# Altium schematic sheet Page-1.schdoc: CPU Module
size 320 x 360 mm; CompanyName: InSYS; DrawnBy: NaveenKumar; Revision: 2.0; SheetNumber: 1; SheetTotal: 10; Title2: Gateway
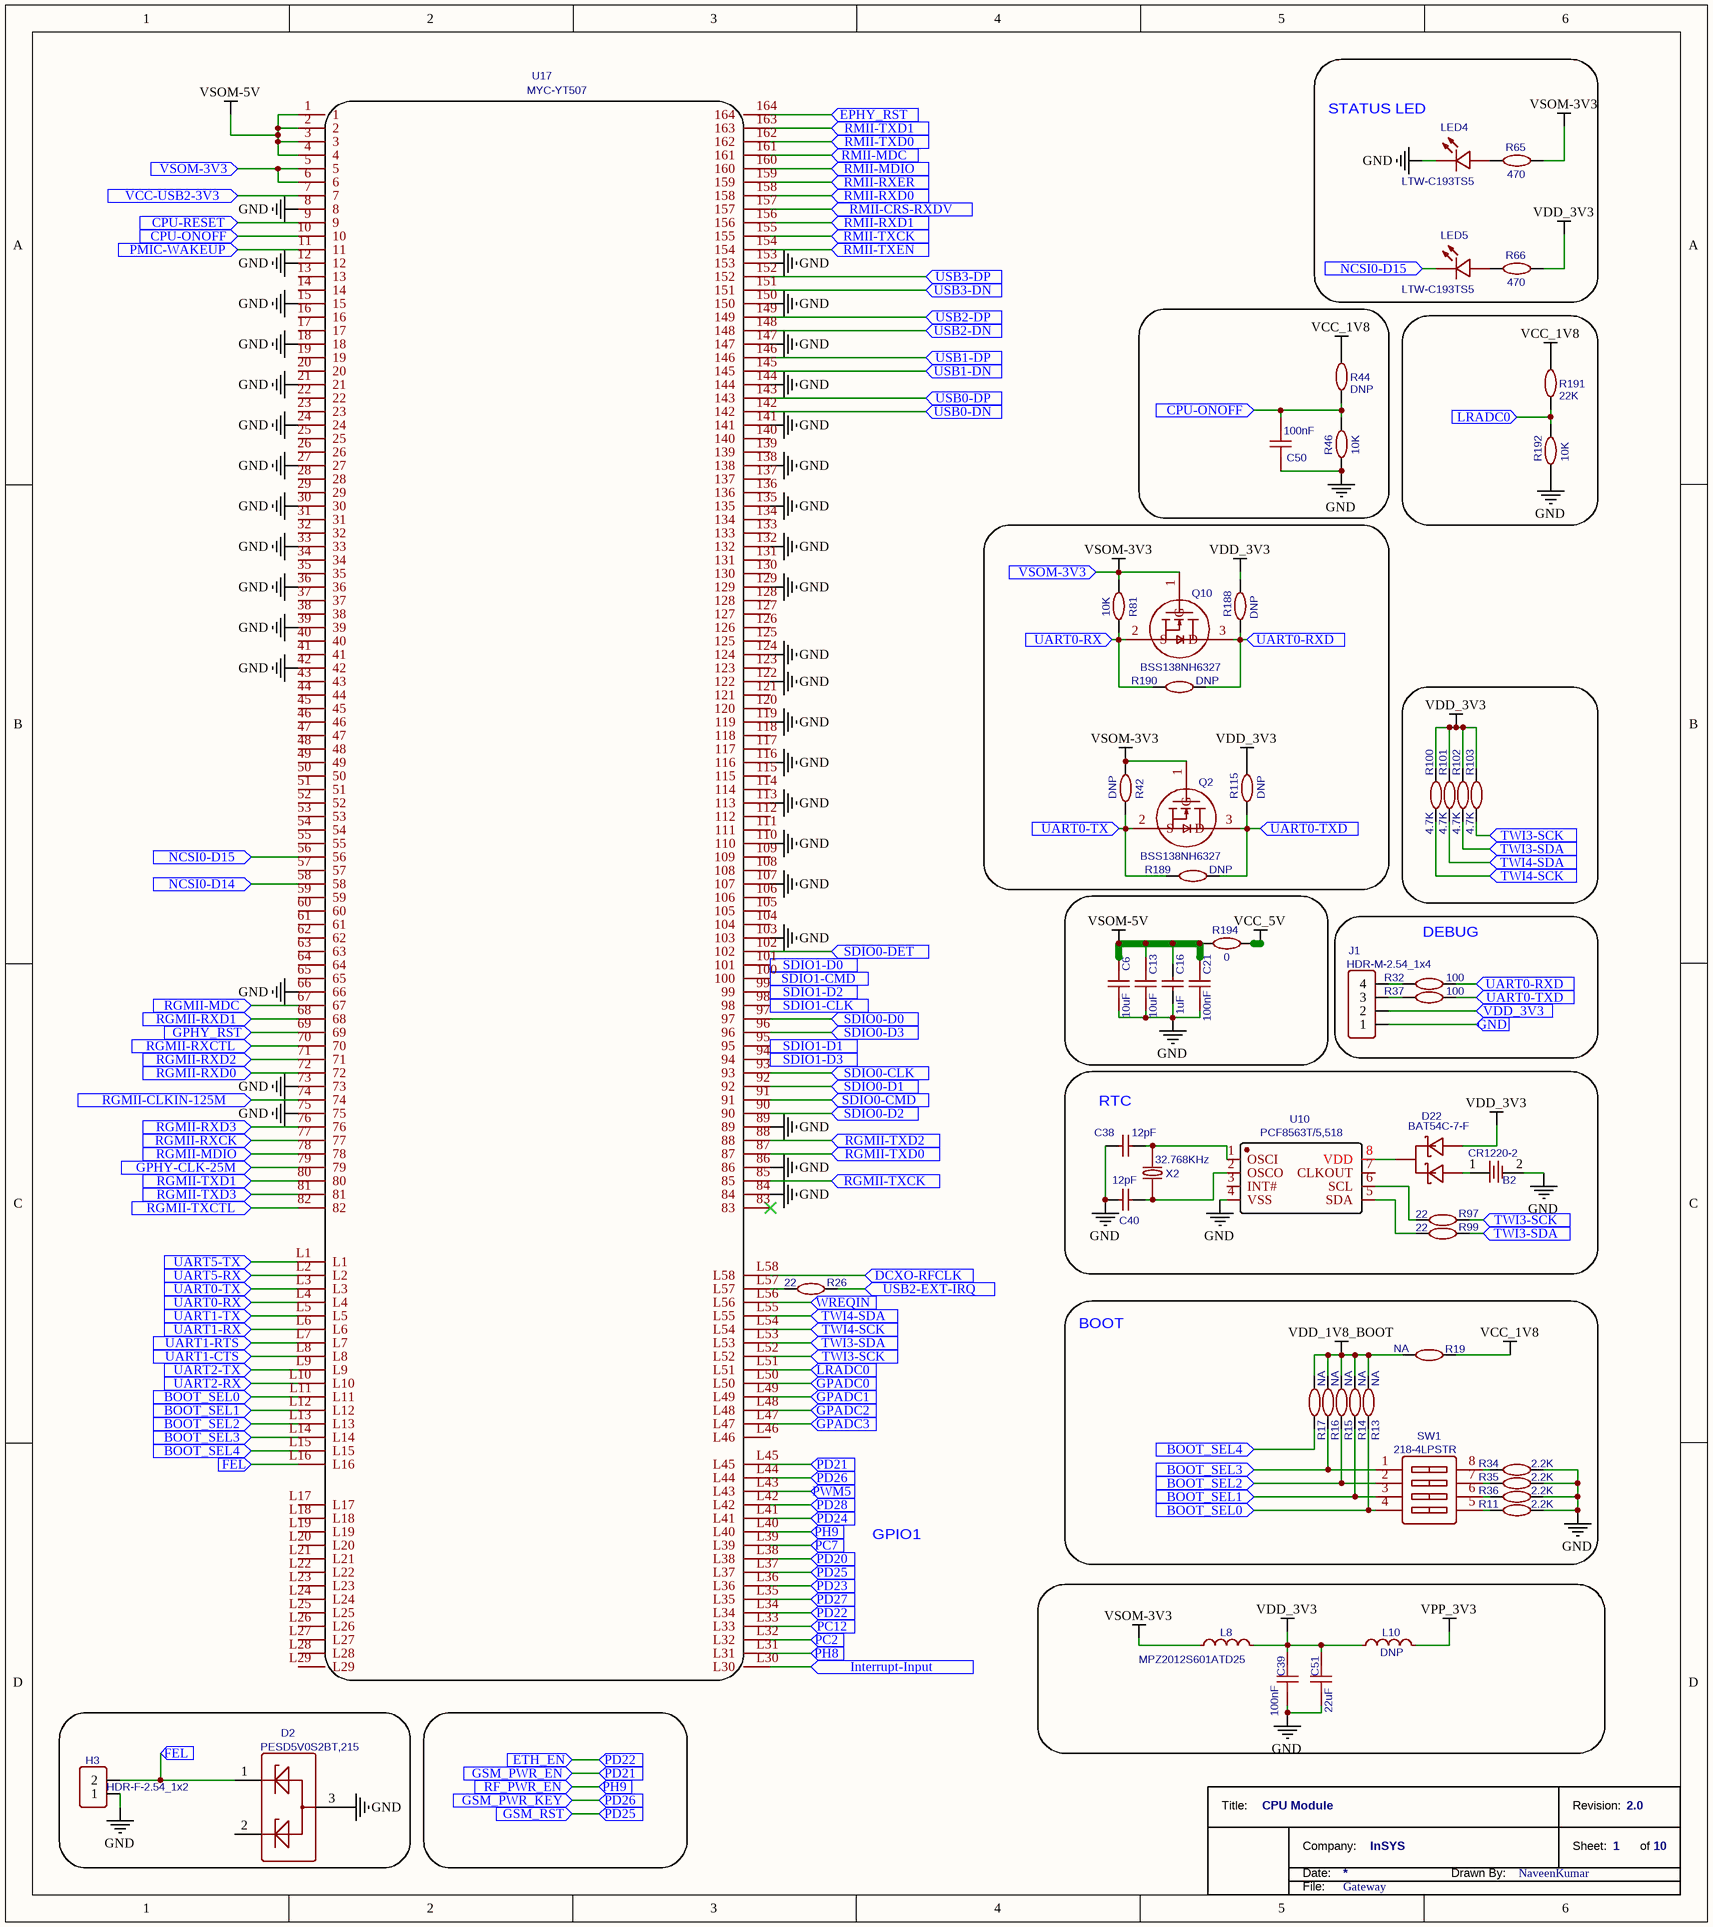
[diagram p0: Page-1.schdoc]

## Parts
*  TitleBlock_1  (value not drawn)  (graphical)
B2  CR1220-2  [GWAY_CR12202_SMD_Holder]
C6  10uF  [GWAY_Capacitor_0805]
C13  10uF  [GWAY_Capacitor_0805]
C16  1uF  [GWAY_Capacitor_0603]
C21  100nF  [GWAY_Capacitor_0603]
C38  12pF  [GWAY_Capacitor_0603]
C39  100nF  [GWAY_Capacitor_0603]
C40  12pF  [GWAY_Capacitor_0603]
C50  100nF  [GWAY_Capacitor_0603]
C51  22uF  [GWAY_Capacitor_0805]
D2  PESD5V0S2BT,215  [GWAY_SOT23-3PIN]
D22  BAT54C-7-F  [GWAY_SOT23-3PIN]
H3  HDR-F-2.54_1x2  [GWAY_2Way_Header_Conn]
J1  HDR-M-2.54_1x4  [GWAY_4Way_Header_Conn]
L8  MPZ2012S601ATD25  [GWAY_FerriteeBEAD_0805_C2012X105N]
L10  DNP  [GWAY_FerriteeBEAD_0805_C2012X105N]
LED4  LTW-C193TS5  [GWAY_Led_RED_0603]
LED5  LTW-C193TS5  [GWAY_Led_RED_0603]
Q2  BSS138NH6327  [GWAY_SOT23-3PIN]
Q10  BSS138NH6327  [GWAY_SOT23-3PIN]
R11  2.2K  [GWAY_Resistor_0603]
R13  NA  [GWAY_Resistor_0603]
R14  NA  [GWAY_Resistor_0603]
R15  NA  [GWAY_Resistor_0603]
R16  NA  [GWAY_Resistor_0603]
R17  NA  [GWAY_Resistor_0603]
R19  NA  [GWAY_Resistor_0603]
R26  22  [GWAY_Resistor_0603]
R32  100  [GWAY_Resistor_0603]
R34  2.2K  [GWAY_Resistor_0603]
R35  2.2K  [GWAY_Resistor_0603]
R36  2.2K  [GWAY_Resistor_0603]
R37  100  [GWAY_Resistor_0603]
R42  DNP  [GWAY_Resistor_0603]
R44  DNP  [GWAY_Resistor_0805]
R46  10K  [GWAY_Resistor_0603]
R65  470  [GWAY_Resistor_0603]
R66  470  [GWAY_Resistor_0603]
R81  10K  [GWAY_Resistor_0603]
R97  22  [GWAY_Resistor_0603]
R99  22  [GWAY_Resistor_0603]
R100  4.7K  [GWAY_Resistor_0603]
R101  4.7K  [GWAY_Resistor_0603]
R102  4.7K  [GWAY_Resistor_0603]
R103  4.7K  [GWAY_Resistor_0603]
R115  DNP  [GWAY_Resistor_0603]
R188  DNP  [GWAY_Resistor_0603]
R189  DNP  [GWAY_Resistor_0603]
R190  DNP  [GWAY_Resistor_0603]
R191  22K  [GWAY_Resistor_0805]
R192  10K  [GWAY_Resistor_0603]
R194  0  [GWAY_Resistor_0603]
SW1  218-4LPSTR  [GWAY_SW-SMD_218-4LPSTR]
U10  PCF8563T/5,518  [GWay_SOIC8]
U17  MYC-YT507  [GWay_MYC-YT507]
X2  32.768KHz  [GWAY_CRYSTAL 32.768MHZ_SMD]

## Blocks framed on the sheet
STATUS LED: LED4 LED5 R65 R66
DEBUG: J1 R32 R37
RTC: B2 C38 C40 D22 R97 R99 U10 X2
BOOT: R11 R13-R17 R19 R34-R36 SW1

## Ports
BOOT_SEL0 (in), BOOT_SEL1 (in), BOOT_SEL2 (in), BOOT_SEL3 (in), BOOT_SEL4 (in), CPU-ONOFF (in), CPU-RESET (in), DCXO-RFCLK (in), EPHY_RST (in), ETH_EN (in), FEL (in), GND (in), GPADC0 (in), GPADC1 (in), GPADC2 (in), GPADC3 (in), GPHY-CLK-25M (in), GPHY_RST (in), GSM_PWR_EN (in), GSM_PWR_KEY (in), GSM_RST (in), Interrupt-Input (in), LRADC0 (in), NCSI0-D14 (in), NCSI0-D15 (in), PC2 (in), PC7 (in), PC12 (in), PD20 (in), PD21 (in), PD22 (in), PD23 (in), PD24 (in), PD25 (in), PD26 (in), PD27 (in), PD28 (in), PH8 (in), PH9 (in), PMIC-WAKEUP (in), PWM5 (in), RF_PWR_EN (in), RGMII-CLKIN-125M (in), RGMII-MDC (in), RGMII-MDIO (in), RGMII-RXCK (in), RGMII-RXCTL (in), RGMII-RXD0 (in), RGMII-RXD1 (in), RGMII-RXD2 (in), RGMII-RXD3 (in), RGMII-TXCK (in), RGMII-TXCTL (in), RGMII-TXD0 (in), RGMII-TXD1 (in), RGMII-TXD2 (in), RGMII-TXD3 (in), RMII-CRS-RXDV (in), RMII-MDC (in), RMII-MDIO (in), RMII-RXD0 (in), RMII-RXD1 (in), RMII-RXER (in), RMII-TXCK (in), RMII-TXD0 (in), RMII-TXD1 (in), RMII-TXEN (in), SDIO0-CLK (in), SDIO0-CMD (in), SDIO0-D0 (in), SDIO0-D1 (in), SDIO0-D2 (in), SDIO0-D3 (in), SDIO0-DET (in), SDIO1-CLK (in), SDIO1-CMD (in), SDIO1-D0 (in), SDIO1-D1 (in), SDIO1-D2 (in), SDIO1-D3 (in), TWI3-SCK (in), TWI3-SDA (in), TWI4-SCK (in), TWI4-SDA (in), UART0-RX (in), UART0-RXD (in), UART0-TX (in), UART0-TXD (in), UART1-CTS (in), UART1-RTS (in), UART1-RX (in), UART1-TX (in), UART2-RX (in), UART2-TX (in), UART5-RX (in), UART5-TX (in), USB0-DN (in), USB0-DP (in), USB1-DN (in), USB1-DP (in), USB2-DN (in), USB2-DP (in), USB2-EXT-IRQ (in), USB3-DN (in), USB3-DP (in), VCC-USB2-3V3 (in), VDD_3V3 (in), VSOM-3V3 (in), WREQIN (in)

## Nets
GND: B2.2 C6.1 C13.1 C16.2 C21.1 C38.1 C39.2 C40.1 C50.2 C51.1 D2.3 H3.1 LED4.1(-) R11.1 R34.1 R35.1 R36.1 R46.1 R192.1 U10.4(VSS) U17.8 U17.12 U17.15 U17.18 U17.21 U17.24 U17.27 U17.30 U17.33 U17.36 U17.39 U17.42 U17.66 U17.73 U17.75 U17.84 U17.86 U17.89 U17.103 U17.107 U17.110 U17.113 U17.116 U17.119 U17.122 U17.124 U17.129 U17.132 U17.135 U17.138 U17.141 U17.144 U17.147 U17.150 U17.153
VCC_1V8: R19.1 R44.2 R191.2
VCC_5V: R194.1
VDD_1V8_BOOT: R13.2 R14.2 R15.2 R16.2 R17.2 R19.2
VDD_3V3: C39.1 C51.2 D22.2(A) L8.2 L10.1 R66.2 R100.2 R101.2 R102.2 R103.2 R115.2 R188.2
VPP_3V3: L10.2
VSOM-3V3: L8.1 Q2.1(G) Q10.1(G) R42.2 R65.2 R81.2 U17.5 U17.6 ; port VSOM-3V3
VSOM-5V: C6.2 C13.2 C16.1 C21.2 R194.2 U17.1 U17.2 U17.3 U17.4
BOOT_SEL0: R13.1 SW1.4 U17.L11 ; port BOOT_SEL0
BOOT_SEL1: R14.1 SW1.3 U17.L12 ; port BOOT_SEL1
BOOT_SEL2: R15.1 SW1.2 U17.L13 ; port BOOT_SEL2
BOOT_SEL3: R16.1 SW1.1 U17.L14 ; port BOOT_SEL3
BOOT_SEL4: R17.1 U17.L15 ; port BOOT_SEL4
CPU-ONOFF: C50.1 R44.1 R46.2 U17.10 ; port CPU-ONOFF
CPU-RESET: U17.9 ; port CPU-RESET
DCXO-RFCLK: U17.L58 ; port DCXO-RFCLK
EPHY_RST: U17.164 ; port EPHY_RST
ETH_EN: U17.L34 ; port PD22, port ETH_EN
FEL: D2.1 H3.2 U17.L16 ; port FEL
GND: J1.1 ; port GND  [a separate net that carries the same name]
GPADC0: U17.L50 ; port GPADC0
GPADC1: U17.L49 ; port GPADC1
GPADC2: U17.L48 ; port GPADC2
GPADC3: U17.L47 ; port GPADC3
GPHY-CLK-25M: U17.79 ; port GPHY-CLK-25M
GPHY_RST: U17.69 ; port GPHY_RST
GSM_PWR_EN: U17.L45 ; port GSM_PWR_EN, port PD21
GSM_PWR_KEY: U17.L44 ; port GSM_PWR_KEY, port PD26
GSM_RST: U17.L37 ; port PD25, port GSM_RST
Interrupt-Input: U17.L30 ; port Interrupt-Input
LRADC0: R191.1 R192.2 U17.L51 ; port LRADC0
NCSI0-D14: U17.58 ; port NCSI0-D14
NCSI0-D15: LED5.1(-) U17.56 ; port NCSI0-D15
PC2: U17.L32 ; port PC2
PC7: U17.L39 ; port PC7
PC12: U17.L33 ; port PC12
PD20: U17.L38 ; port PD20
PD23: U17.L36 ; port PD23
PD24: U17.L41 ; port PD24
PD27: U17.L35 ; port PD27
PD28: U17.L42 ; port PD28
PH8: U17.L31 ; port PH8
PH9: U17.L40 ; port RF_PWR_EN, port PH9
PMIC-WAKEUP: U17.11 ; port PMIC-WAKEUP
PWM5: U17.L43 ; port PWM5
RGMII-CLKIN-125M: U17.74 ; port RGMII-CLKIN-125M
RGMII-MDC: U17.67 ; port RGMII-MDC
RGMII-MDIO: U17.78 ; port RGMII-MDIO
RGMII-RXCK: U17.77 ; port RGMII-RXCK
RGMII-RXCTL: U17.70 ; port RGMII-RXCTL
RGMII-RXD0: U17.72 ; port RGMII-RXD0
RGMII-RXD1: U17.68 ; port RGMII-RXD1
RGMII-RXD2: U17.71 ; port RGMII-RXD2
RGMII-RXD3: U17.76 ; port RGMII-RXD3
RGMII-TXCK: U17.85 ; port RGMII-TXCK
RGMII-TXCTL: U17.82 ; port RGMII-TXCTL
RGMII-TXD0: U17.87 ; port RGMII-TXD0
RGMII-TXD1: U17.80 ; port RGMII-TXD1
RGMII-TXD2: U17.88 ; port RGMII-TXD2
RGMII-TXD3: U17.81 ; port RGMII-TXD3
RMII-CRS-RXDV: U17.157 ; port RMII-CRS-RXDV
RMII-MDC: U17.161 ; port RMII-MDC
RMII-MDIO: U17.160 ; port RMII-MDIO
RMII-RXD0: U17.158 ; port RMII-RXD0
RMII-RXD1: U17.156 ; port RMII-RXD1
RMII-RXER: U17.159 ; port RMII-RXER
RMII-TXCK: U17.155 ; port RMII-TXCK
RMII-TXD0: U17.162 ; port RMII-TXD0
RMII-TXD1: U17.163 ; port RMII-TXD1
RMII-TXEN: U17.154 ; port RMII-TXEN
SDIO0-CLK: U17.93 ; port SDIO0-CLK
SDIO0-CMD: U17.91 ; port SDIO0-CMD
SDIO0-D0: U17.97 ; port SDIO0-D0
SDIO0-D1: U17.92 ; port SDIO0-D1
SDIO0-D2: U17.90 ; port SDIO0-D2
SDIO0-D3: U17.96 ; port SDIO0-D3
SDIO0-DET: U17.102 ; port SDIO0-DET
SDIO1-CLK: U17.98 ; port SDIO1-CLK
SDIO1-CMD: U17.100 ; port SDIO1-CMD
SDIO1-D0: U17.101 ; port SDIO1-D0
SDIO1-D1: U17.95 ; port SDIO1-D1
SDIO1-D2: U17.99 ; port SDIO1-D2
SDIO1-D3: U17.94 ; port SDIO1-D3
TWI3-SCK: R97.2 R103.1 U17.L52 ; port TWI3-SCK
TWI3-SDA: R99.2 R102.1 U17.L53 ; port TWI3-SDA
TWI4-SCK: R100.1 U17.L54 ; port TWI4-SCK
TWI4-SDA: R101.1 U17.L55 ; port TWI4-SDA
UART0-RX: Q10.2(S) R81.1 R190.2 U17.L4 ; port UART0-RX
UART0-RXD: Q10.3(D) R32.2 R188.1 R190.1 ; port UART0-RXD
UART0-TX: Q2.2(S) R42.1 R189.2 U17.L3 ; port UART0-TX
UART0-TXD: Q2.3(D) R37.2 R115.1 R189.1 ; port UART0-TXD
UART1-CTS: U17.L8 ; port UART1-CTS
UART1-RTS: U17.L7 ; port UART1-RTS
UART1-RX: U17.L6 ; port UART1-RX
UART1-TX: U17.L5 ; port UART1-TX
UART2-RX: U17.L10 ; port UART2-RX
UART2-TX: U17.L9 ; port UART2-TX
UART5-RX: U17.L2 ; port UART5-RX
UART5-TX: U17.L1 ; port UART5-TX
USB0-DN: U17.142 ; port USB0-DN
USB0-DP: U17.143 ; port USB0-DP
USB1-DN: U17.145 ; port USB1-DN
USB1-DP: U17.146 ; port USB1-DP
USB2-DN: U17.148 ; port USB2-DN
USB2-DP: U17.149 ; port USB2-DP
USB2-EXT-IRQ: R26.2 ; port USB2-EXT-IRQ
USB3-DN: U17.151 ; port USB3-DN
USB3-DP: U17.152 ; port USB3-DP
VCC-USB2-3V3: U17.7 ; port VCC-USB2-3V3
VDD_3V3: J1.2 ; port VDD_3V3  [a separate net that carries the same name]
WREQIN: U17.L56 ; port WREQIN
NetB2_1: B2.1 D22.1(A)
NetC38_2: C38.2 U10.1(OSCI) X2.2
NetC40_2: C40.2 U10.2(OSCO) X2.1
NetD22_3: D22.3(K) U10.8(VDD)
NetJ1_3: J1.3 R37.1
NetJ1_4: J1.4 R32.1
NetLED4_2: LED4.2(+) R65.1
NetLED5_2: LED5.2(+) R66.1
NetR11_2: R11.2 SW1.5
NetR26_1: R26.1 U17.L57
NetR34_2: R34.2 SW1.8
NetR35_2: R35.2 SW1.7
NetR36_2: R36.2 SW1.6
NetR97_1: R97.1 U10.6(SCL)
NetR99_1: R99.1 U10.5(SDA)

Not connected (* = marked no-connect by the designer): D2 2; U10 3(INT#) 7(CLKOUT); U17 13 14 16 17 19 20 22 23 25 26 28 29 31 32 34 35 37 38 40 41 43 44 45 46 47 48 49 50 51 52 53 54 55 57 59 60 61 62 63 64 65 83* 104 105 106 108 109 111 112 114 115 117 118 120 121 123 125 126 127 128 130 131 133 134 136 137 139 140 L17 L18 L19 L20 L21 L22 L23 L24 L25 L26 L27 L28 L29 L46

## Notes on the sheet
- GPIO1
- (in symbol TitleBlock_1) Title:; Revision:; Company:; Sheet:; of; Date:; Drawn By:; File:

## Library data of the parts
* = TitleBlock_1: TitleBlock  No-2; TitleName: *; Company: *; Drawn By: *; File: *
B2 = CR1220-2: Manufacturer: Q&J; Supplier: LCSC; Manufacturer Part: CR1220-2; image: //image.lceda.cn/szlcsc/C70381.jpg; Supplier Part: C70381; spicePre: B
C6 C13 = 10uF: Manufacturer: SAMSUNG(三星); Manufacturer Part: CL21B106KOQNNNE; nameAlias: Capacitance; Supplier: LCSC; Supplier Part: C95841; JLCPCB Part Class: Extended Part; spicePre: C; spiceSymbolName: CL21B106KOQNNNE
C16 = 1uF: Manufacturer Part: CL10B105KA8NNNC; Manufacturer: SAMSUNG(三星); nameAlias: Capacitance; Supplier: LCSC; Supplier Part: C29936; JLCPCB Part Class: Extended Part; spicePre: C; spiceSymbolName: CL10B105KA8NNNC
C21 C39 C50 = 100nF: Manufacturer: SAMSUNG; Manufacturer Part: CL10B104KB8NNNC; nameAlias: Capacitance; Supplier: LCSC; Supplier Part: C1591; spicePre: C; spiceSymbolName: CL10B104KB8NNNC
C38 C40 = 12pF: Manufacturer Part: CL10C120JB8NNNC; Manufacturer: SAMSUNG; nameAlias: Capacitance; SMT Type: Basic; Supplier: LCSC; LCSC Assembly: Yes; Supplier Part: C38523; spicePre: C; spiceSymbolName: CL10C120JB8NNNC
C51 = 22uF: Manufacturer: SAMSUNG; Manufacturer Part: CL21A226MQQNNNE; nameAlias: Capacitance; Supplier: LCSC; Supplier Part: C5674; spicePre: C; spiceSymbolName: CL21A226MQQNNNE
D2 = PESD5V0S2BT,215: Manufacturer: Nexperia(安世); Supplier: LCSC; Manufacturer Part: PESD5V0S2BT,215; Supplier Part: C49338; JLCPCB Part Class: Extended Part; spicePre: D; spiceSymbolName: PESD5V0S2BT,215
D22 = BAT54C-7-F: Manufacturer: DIODES; Contributor: LCSC; SMT Type: Extend; Supplier: LCSC; Manufacturer Part: BAT54C-7-F; Supplier Part: C134405; LCSC Assembly: Yes; spicePre: D
H3 = HDR-F-2.54_1x2: Contributor: LCEDA_Lib; Supplier Part: C49661; Supplier: LCSC; spicePre: H; spiceSymbolName: HDR-F-2.54_1x2
J1 = HDR-M-2.54_1x4: Contributor: LCEDA_Lib; Supplier Part: C124378; Supplier: LCSC; spicePre: J; spiceSymbolName: HDR-M-2.54_1x4
L8 = MPZ2012S601ATD25: Manufacturer: TDK; Contributor: LCSC; Supplier: LCSC; Supplier Part: C81034; Manufacturer Part: MPZ2012S601ATD25; JLCPCB Part Class: Extended Part; spicePre: L; spiceSymbolName: MPZ2012S601ATD25
L10 = DNP: Manufacturer: TDK; Manufacturer Part: MPZ2012S601ATD25; Contributor: LCSC; Supplier: LCSC; Supplier Part: C81034; JLCPCB Part Class: Extended Part; spicePre: L; spiceSymbolName: MPZ2012S601ATD25
LED4 LED5 = LTW-C193TS5: Manufacturer: LITEON; Contributor: LCSC; Supplier: LCSC; Manufacturer Part: LTW-C193TS5; Supplier Part: C115462; spicePre: L; spiceSymbolName: LTW-C193TS5
Q2 Q10 = BSS138NH6327: Manufacturer: Infineon; Contributor: LCSC; Supplier: LCSC; Manufacturer Part: BSS138NH6327; Supplier Part: C94638; JLCPCB Part Class: Extended Part; spicePre: Q; spiceSymbolName: BSS138NH6327
R11 R34-R36 = 2.2K: Manufacturer: YAGEO; Manufacturer Part: RC0603FR-072K2L; nameAlias: Resistance (Ohms); Supplier: LCSC; Supplier Part: C114662; JLCPCB Part Class: Extended Part; spicePre: R; spiceSymbolName: RC0603FR-072K2L
R13-R17 = NA: Manufacturer: YAGEO; Manufacturer Part: RC0603JR-0710KL; nameAlias: Resistance (Ohms); Supplier: LCSC; Supplier Part: C99198; spicePre: R; spiceSymbolName: RC0603JR-0710KL
R19 = NA: Manufacturer: YAGEO; Manufacturer Part: RC0603FR-070RL; nameAlias: Resistance (Ohms); Supplier: LCSC; Supplier Part: C100044; spicePre: R; spiceSymbolName: RC0603FR-070RL
R26 R97 R99 = 22: Manufacturer: YAGEO; Manufacturer Part: RC0603FR-0722RL; nameAlias: Resistance (Ohms); Supplier: LCSC; Supplier Part: C107701; spicePre: R; spiceSymbolName: RC0603FR-0722RL
R32 R37 = 100: Manufacturer: YAGEO; Manufacturer Part: RC0603FR-07100RL; nameAlias: Resistance (Ohms); Resistance: 100Ω; Supplier: LCSC; Supplier Part: C105588; JLCPCB Part Class: Extended Part; spicePre: R; spiceSymbolName: RC0603FR-07100RL
R42 R115 R188-R190 = DNP: Manufacturer: YAGEO; Manufacturer Part: RC0603JR-0710KL; nameAlias: Resistance (Ohms); Supplier: LCSC; Supplier Part: C99198; spicePre: R; spiceSymbolName: RC0603JR-0710KL
R44 = DNP: Manufacturer: YAGEO; Manufacturer Part: RC0805JR-0722KL; nameAlias: Resistance (Ohms); Supplier: LCSC; Supplier Part: C114231; spicePre: R; spiceSymbolName: RC0805JR-0722KL
R46 R81 R192 = 10K: Manufacturer: YAGEO; Manufacturer Part: RC0603JR-0710KL; nameAlias: Resistance (Ohms); Supplier: LCSC; Supplier Part: C99198; spicePre: R; spiceSymbolName: RC0603JR-0710KL
R65 R66 = 470: Manufacturer: YAGEO; Manufacturer Part: RC0603FR-07470RL; nameAlias: Resistance (Ohms); Supplier: LCSC; Supplier Part: C114669; JLCPCB Part Class: Extended Part; spicePre: R; spiceSymbolName: RC0603FR-07470RL
R100-R103 = 4.7K: Manufacturer: YAGEO; Manufacturer Part: RC0603FR-074K7L; nameAlias: Resistance (Ohms); Supplier: LCSC; Supplier Part: C99782; spicePre: R; spiceSymbolName: RC0603FR-074K7L
R191 = 22K: Manufacturer: YAGEO; Manufacturer Part: RC0805JR-0722KL; nameAlias: Resistance (Ohms); Supplier: LCSC; Supplier Part: C114231; spicePre: R; spiceSymbolName: RC0805JR-0722KL
R194 = 0: Manufacturer: YAGEO; Manufacturer Part: RC0603FR-070RL; nameAlias: Resistance (Ohms); Supplier: LCSC; Supplier Part: C100044; spicePre: R; spiceSymbolName: RC0603FR-070RL
SW1 = 218-4LPSTR: Manufacturer: CTS Electronic Components; Contributor: LCSC; Supplier: LCSC; Supplier Part: C358628; Manufacturer Part: 218-4LPSTR; JLCPCB Part Class: Extended Part; spicePre: S; spiceSymbolName: 218-4LPSTR
U10 = PCF8563T/5,518: Manufacturer: NXP(恩智浦); Supplier: LCSC; Manufacturer Part: PCF8563T/5,518; Supplier Part: C7440; JLCPCB Part Class: Basic Part; spicePre: U; spiceSymbolName: PCF8563T/5,518
U17 = MYC-YT507: Manufacturer: MYIR; Contributor: orbeebabu; Manufacturer Part: MYC-YT507; spicePre: U; spiceSymbolName: MYC-YT507
X2 = 32.768KHz: Manufacturer: SEIKO; Manufacturer Part: SC-32S32.768kHz20PPM12.5pF; nameAlias: Frequency; SMT Type: Extend; Supplier: LCSC; Supplier Part: C97606; LCSC Assembly: Yes; spicePre: X; spiceSymbolName: SC-32S32.768kHz20PPM12.5pF